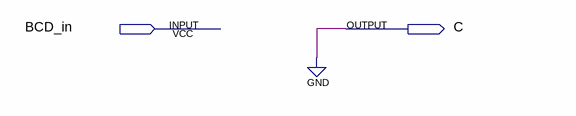
[diagram p0: schematic sheet]
// Quartus schematic DECOD_BCD_C.bdf as structural Verilog: 0 symbols, 2 pins
module DECOD_BCD_C (
  input  BCD_in,
  output C
);


  assign C = 1'b0;
endmodule
